# Altium schematic sheet FMC_DAC_1_5GS_4CH.schdoc: FMC DAC 1.5GS 4CH
size 420 x 297 mm; EDA_Number: ARTIQ; Projet: ARTIQ/SINARA; Author: G.Kasprowicz; CompanyName: WUT ISE; DrawnBy: G.Kasprowicz; Organization: WUT ISE; Address1: PW ISE; Address2: Nowowiejska 15/19 00-665 Warsaw; Address3: gkasprow@gmail.com; DocumentNumber: 1; Revision: 1; SheetNumber: 1; SheetTotal: 18; ModifiedBy: -; CheckedDate: -; Title2: Top; DivGrp: WUT ISE; Designer: G.Kasprowicz; ModifiedDate: -; ProjectName: Sensor Box
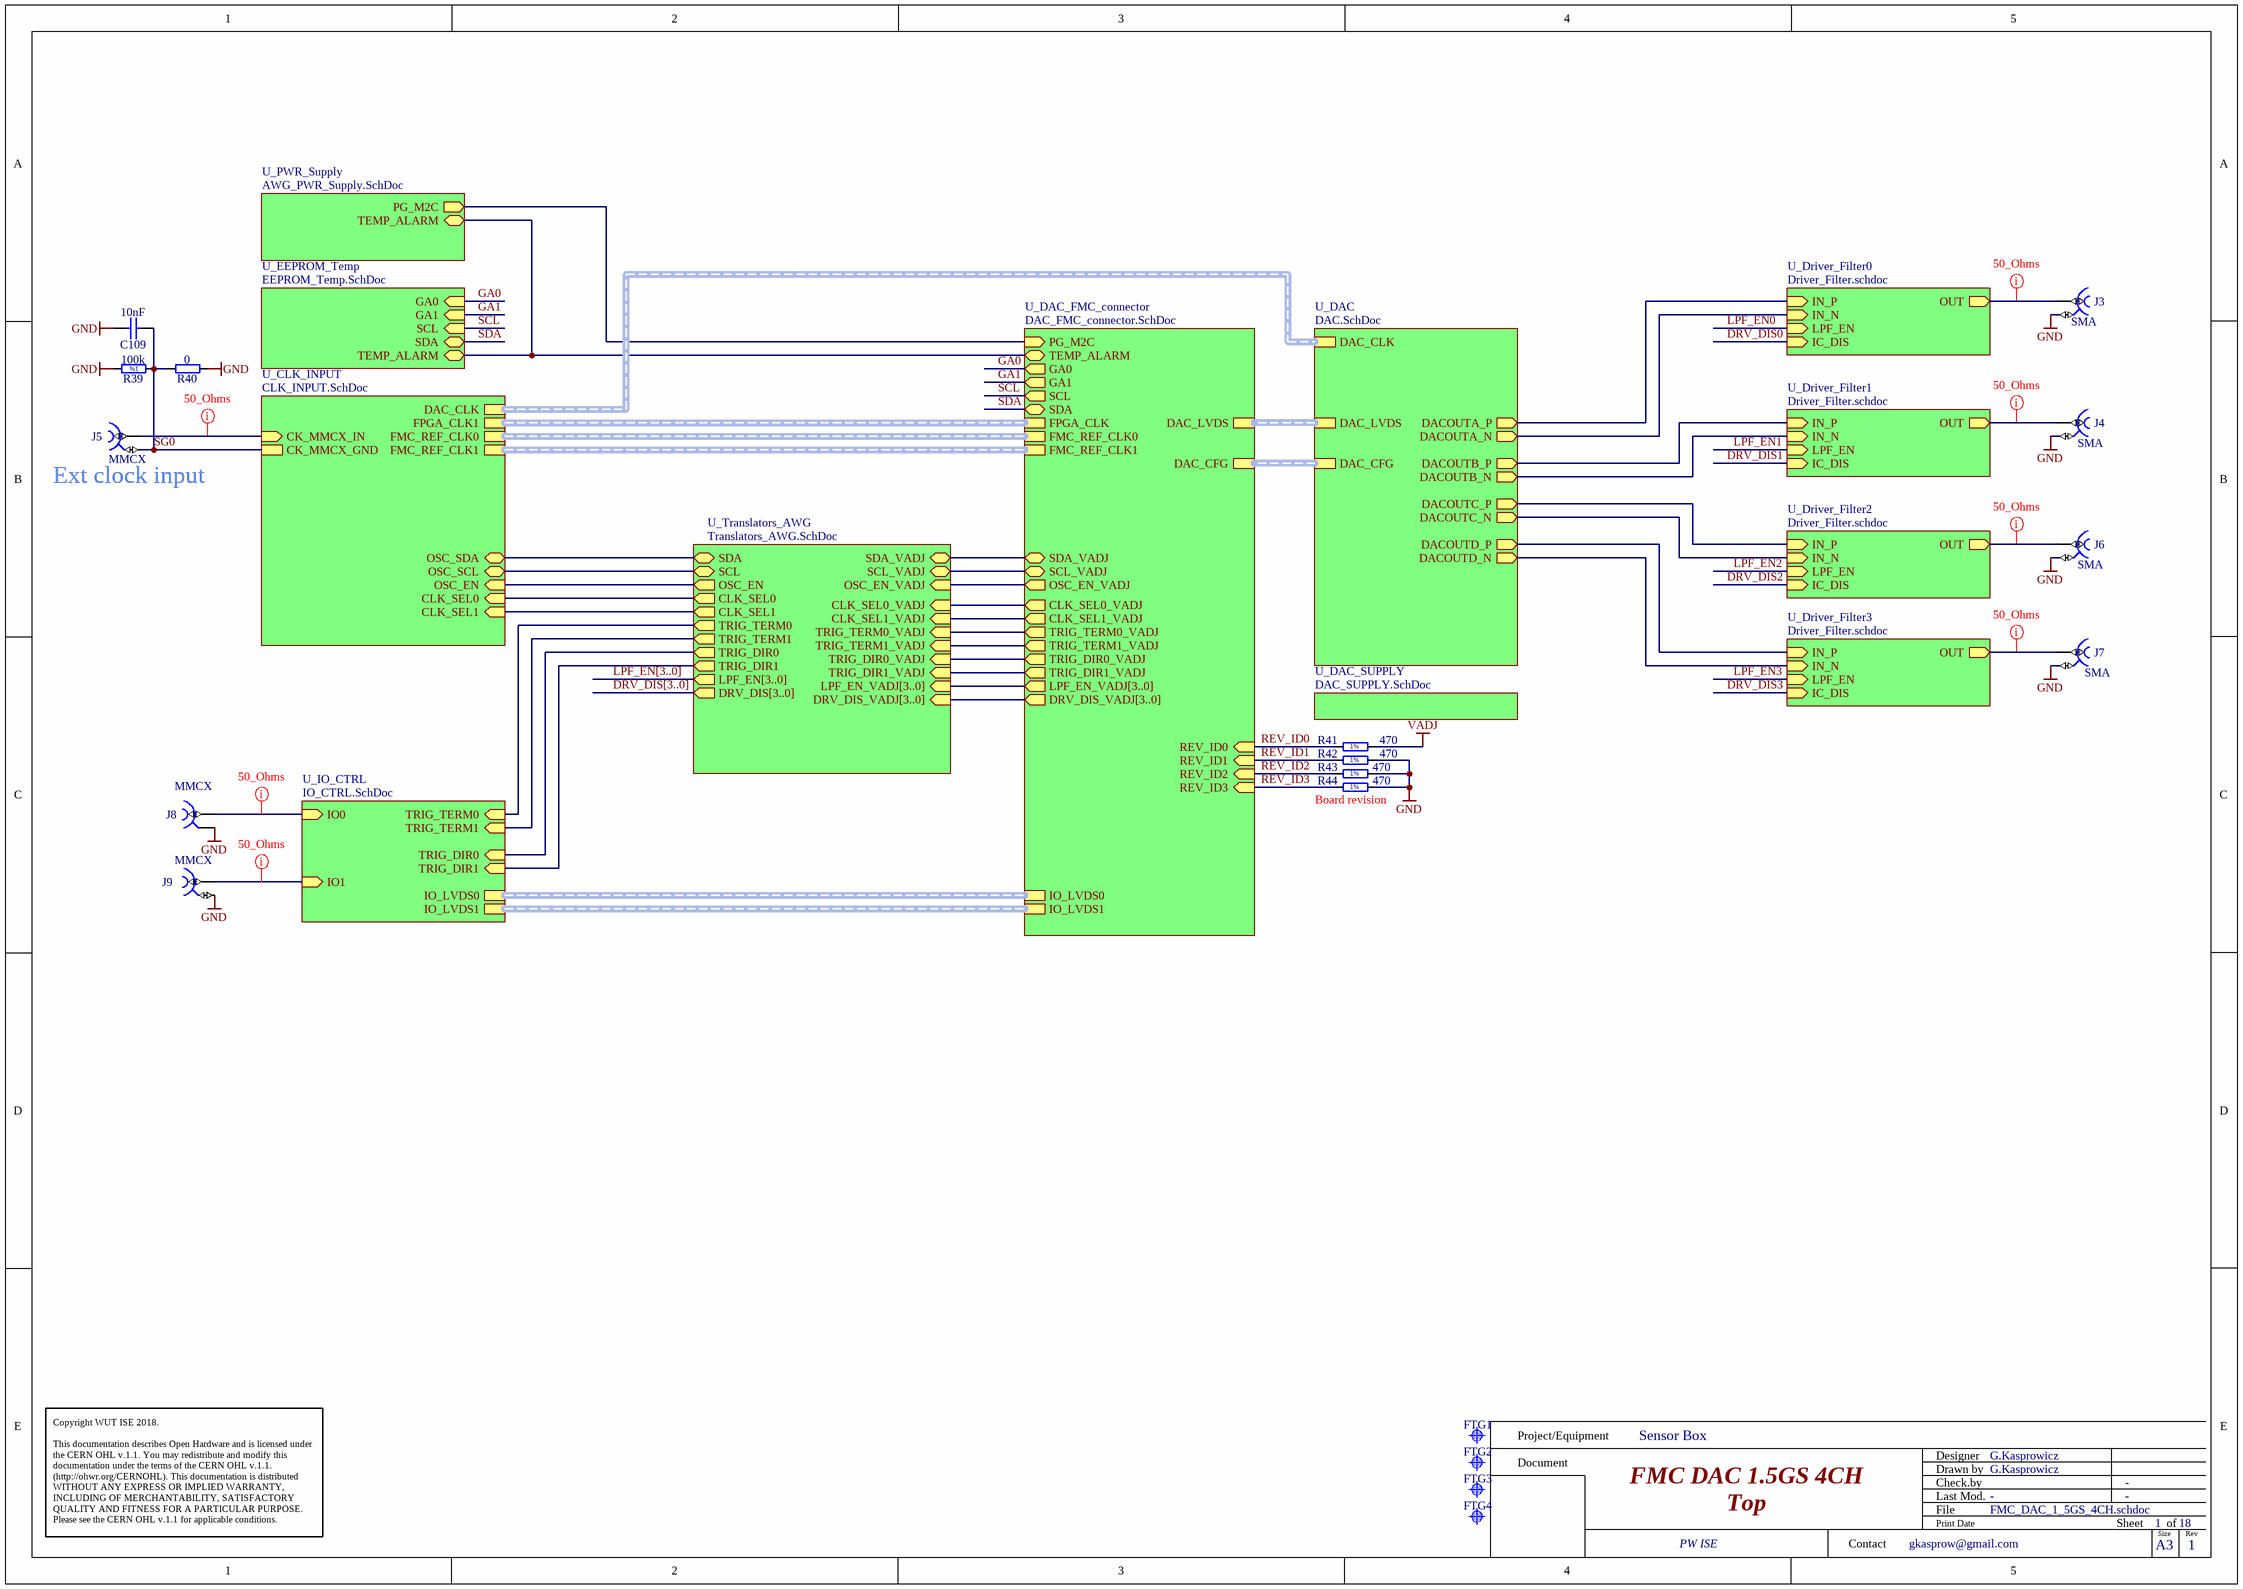
[diagram p0: FMC_DAC_1_5GS_4CH.schdoc]

## Parts
C109  10nF  [CAPC1005X55N]
FTG1  Use only in PCB  [FIDUCIAL_TOP_C100-200]  (value not drawn)  (no BOM)
FTG2  Use only in PCB  [FIDUCIAL_TOP_S100-200]  (value not drawn)  (no BOM)
FTG3  Use only in PCB  [FIDUCIAL_TOP_S100-200]  (value not drawn)  (no BOM)
FTG4  Use only in PCB  [FIDUCIAL_TOP_S100-200]  (value not drawn)  (no BOM)
J3  SMA  [AMPHENOL_901-143]
J4  SMA  [AMPHENOL_901-143]
J5  Family: MMCX  [HUBER-SUHNER_85_MMCX-50-0-1/111 OH]  (hidden comment: Coax_1Female_1Shield)
J6  SMA  [AMPHENOL_901-143]
J7  SMA  [AMPHENOL_901-143]
J8  Family: MMCX  [HUBER-SUHNER_85_MMCX-50-0-1/111 OH]  (hidden comment: Coax_1Female_1Shield)
J9  Family: MMCX  [HUBER-SUHNER_85_MMCX-50-0-1/111 OH]  (hidden comment: Coax_1Female_1Shield)
R39  100k  [RESC1005X40N]
R40  0  [RESC1608X55N]
R41  470  [RESC1005X40N]
R42  470  [RESC1005X40N]
R43  470  [RESC1005X40N]
R44  470  [RESC1005X40N]

## Sub-sheets
U_CLK_INPUT = CLK_INPUT.SchDoc: DAC_CLK (harness CLKDIFF), OSC_EN (in), OSC_SCL (bidir), OSC_SDA (bidir), CK_MMCX_GND, CK_MMCX_IN (in), FPGA_CLK1 (harness CLKDIFF), FMC_REF_CLK0 (harness DIFFCLK), CLK_SEL1 (in), FMC_REF_CLK1 (harness DIFFCLK), CLK_SEL0 (in)
U_DAC = DAC.SchDoc: DAC_CFG (harness DAC_CFG), DAC_LVDS (harness DAC_LVDS), DAC_CLK (harness CLKDIFF), DACOUTA_P (out), DACOUTA_N (out), DACOUTB_N (out), DACOUTB_P (out), DACOUTC_P (out), DACOUTC_N (out), DACOUTD_N (out), DACOUTD_P (out)
U_DAC_FMC_connector = DAC_FMC_connector.SchDoc: GA0 (out), GA1 (out), SCL (out), DAC_LVDS (harness DAC_LVDS), DAC_CFG (harness DAC_CFG), SDA (bidir), FPGA_CLK, TEMP_ALARM (bidir), PG_M2C (in), TRIG_DIR0_VADJ (out), TRIG_TERM0_VADJ (out), SDA_VADJ (bidir), SCL_VADJ (bidir), TRIG_DIR1_VADJ (out), TRIG_TERM1_VADJ (out), IO_LVDS0, IO_LVDS1, OSC_EN_VADJ (out), REV_ID0 (in), REV_ID1 (in), REV_ID2 (in), REV_ID3 (in), FMC_REF_CLK0, FMC_REF_CLK1, CLK_SEL0_VADJ (out), CLK_SEL1_VADJ (out), LPF_EN_VADJ[3..0] (out), DRV_DIS_VADJ[3..0] (out)
U_DAC_SUPPLY = DAC_SUPPLY.SchDoc: no entries
U_Driver_Filter0 = Driver_Filter.schdoc: IN_P (in), IN_N (in), OUT (out), LPF_EN (in), IC_DIS (in)
U_Driver_Filter1 = Driver_Filter.schdoc: IN_P (in), IN_N (in), OUT (out), LPF_EN (in), IC_DIS (in)
U_Driver_Filter2 = Driver_Filter.schdoc: IN_P (in), IN_N (in), OUT (out), LPF_EN (in), IC_DIS (in)
U_Driver_Filter3 = Driver_Filter.schdoc: IN_P (in), IN_N (in), OUT (out), LPF_EN (in), IC_DIS (in)
U_EEPROM_Temp = EEPROM_Temp.SchDoc: SDA (bidir), SCL (in), GA0 (in), GA1 (in), TEMP_ALARM (bidir)
U_IO_CTRL = IO_CTRL.SchDoc: TRIG_DIR0 (in), IO0 (in), TRIG_TERM0 (in), IO_LVDS0 (harness DIFFSIG), TRIG_DIR1 (in), IO1 (in), TRIG_TERM1 (in), IO_LVDS1 (harness DIFFSIG)
U_PWR_Supply = AWG_PWR_Supply.SchDoc: PG_M2C (out), TEMP_ALARM (bidir)
U_Translators_AWG = Translators_AWG.SchDoc: SDA_VADJ (bidir), SCL_VADJ (bidir), SDA (bidir), SCL (bidir), OSC_EN (out), TRIG_TERM0 (out), TRIG_TERM1 (out), TRIG_DIR0 (out), TRIG_DIR1 (out), TRIG_DIR0_VADJ (in), TRIG_DIR1_VADJ (in), TRIG_TERM0_VADJ (in), TRIG_TERM1_VADJ (in), OSC_EN_VADJ (in), CLK_SEL0 (out), CLK_SEL1 (out), CLK_SEL1_VADJ (in), CLK_SEL0_VADJ (in), LPF_EN[3..0] (out), DRV_DIS[3..0] (out), LPF_EN_VADJ[3..0] (in), DRV_DIS_VADJ[3..0] (in)

## Nets
GND: C109.2 J3.2 J4.2 J6.2 J7.2 J8.2 J9.2 R39.1 R40.1 R42.2 R43.2 R44.2
VADJ: R41.2
DRV_DIS0: sheet U_Driver_Filter0/IC_DIS
DRV_DIS1: sheet U_Driver_Filter1/IC_DIS
DRV_DIS2: sheet U_Driver_Filter2/IC_DIS
DRV_DIS3: sheet U_Driver_Filter3/IC_DIS
GA0: sheet U_DAC_FMC_connector/GA0, sheet U_EEPROM_Temp/GA0
GA1: sheet U_DAC_FMC_connector/GA1, sheet U_EEPROM_Temp/GA1
LPF_EN0: sheet U_Driver_Filter0/LPF_EN
LPF_EN1: sheet U_Driver_Filter1/LPF_EN
LPF_EN2: sheet U_Driver_Filter2/LPF_EN
LPF_EN3: sheet U_Driver_Filter3/LPF_EN
REV_ID0: R41.1 ; sheet U_DAC_FMC_connector/REV_ID0
REV_ID1: R42.1 ; sheet U_DAC_FMC_connector/REV_ID1
REV_ID2: R43.1 ; sheet U_DAC_FMC_connector/REV_ID2
REV_ID3: R44.1 ; sheet U_DAC_FMC_connector/REV_ID3
SCL: sheet U_DAC_FMC_connector/SCL, sheet U_EEPROM_Temp/SCL
SDA: sheet U_DAC_FMC_connector/SDA, sheet U_EEPROM_Temp/SDA
SG0: C109.1 J5.2 R39.2 R40.2 ; sheet U_CLK_INPUT/CK_MMCX_GND
NetJ3_1: J3.1 ; sheet U_Driver_Filter0/OUT
NetJ4_1: J4.1 ; sheet U_Driver_Filter1/OUT
NetJ5_1: J5.1 ; sheet U_CLK_INPUT/CK_MMCX_IN
NetJ6_1: J6.1 ; sheet U_Driver_Filter2/OUT
NetJ7_1: J7.1 ; sheet U_Driver_Filter3/OUT
NetJ8_1: J8.1 ; sheet U_IO_CTRL/IO0
NetJ9_1: J9.1 ; sheet U_IO_CTRL/IO1
(unnamed): sheet U_PWR_Supply/PG_M2C, sheet U_DAC_FMC_connector/PG_M2C
(unnamed): sheet U_PWR_Supply/TEMP_ALARM, sheet U_DAC_FMC_connector/TEMP_ALARM, sheet U_EEPROM_Temp/TEMP_ALARM
(unnamed): sheet U_CLK_INPUT/OSC_EN, sheet U_Translators_AWG/OSC_EN
(unnamed): sheet U_CLK_INPUT/OSC_SCL, sheet U_Translators_AWG/SCL
(unnamed): sheet U_CLK_INPUT/OSC_SDA, sheet U_Translators_AWG/SDA
(unnamed): sheet U_CLK_INPUT/CLK_SEL1, sheet U_Translators_AWG/CLK_SEL1
(unnamed): sheet U_CLK_INPUT/CLK_SEL0, sheet U_Translators_AWG/CLK_SEL0
(unnamed): sheet U_DAC/DACOUTA_P, sheet U_Driver_Filter0/IN_P
(unnamed): sheet U_DAC/DACOUTA_N, sheet U_Driver_Filter0/IN_N
(unnamed): sheet U_DAC/DACOUTB_N, sheet U_Driver_Filter1/IN_N
(unnamed): sheet U_DAC/DACOUTB_P, sheet U_Driver_Filter1/IN_P
(unnamed): sheet U_DAC/DACOUTC_P, sheet U_Driver_Filter2/IN_P
(unnamed): sheet U_DAC/DACOUTC_N, sheet U_Driver_Filter2/IN_N
(unnamed): sheet U_DAC/DACOUTD_N, sheet U_Driver_Filter3/IN_N
(unnamed): sheet U_DAC/DACOUTD_P, sheet U_Driver_Filter3/IN_P
(unnamed): sheet U_DAC_FMC_connector/TRIG_DIR0_VADJ, sheet U_Translators_AWG/TRIG_DIR0_VADJ
(unnamed): sheet U_DAC_FMC_connector/TRIG_TERM0_VADJ, sheet U_Translators_AWG/TRIG_TERM0_VADJ
(unnamed): sheet U_DAC_FMC_connector/SDA_VADJ, sheet U_Translators_AWG/SDA_VADJ
(unnamed): sheet U_DAC_FMC_connector/SCL_VADJ, sheet U_Translators_AWG/SCL_VADJ
(unnamed): sheet U_DAC_FMC_connector/TRIG_DIR1_VADJ, sheet U_Translators_AWG/TRIG_DIR1_VADJ
(unnamed): sheet U_DAC_FMC_connector/TRIG_TERM1_VADJ, sheet U_Translators_AWG/TRIG_TERM1_VADJ
(unnamed): sheet U_DAC_FMC_connector/OSC_EN_VADJ, sheet U_Translators_AWG/OSC_EN_VADJ
(unnamed): sheet U_DAC_FMC_connector/CLK_SEL0_VADJ, sheet U_Translators_AWG/CLK_SEL0_VADJ
(unnamed): sheet U_DAC_FMC_connector/CLK_SEL1_VADJ, sheet U_Translators_AWG/CLK_SEL1_VADJ
(unnamed): sheet U_Translators_AWG/TRIG_TERM0, sheet U_IO_CTRL/TRIG_TERM0
(unnamed): sheet U_Translators_AWG/TRIG_TERM1, sheet U_IO_CTRL/TRIG_TERM1
(unnamed): sheet U_Translators_AWG/TRIG_DIR0, sheet U_IO_CTRL/TRIG_DIR0
(unnamed): sheet U_Translators_AWG/TRIG_DIR1, sheet U_IO_CTRL/TRIG_DIR1

## Buses and harness runs
bus DRV_DIS[3..0] = sheet U_Translators_AWG/DRV_DIS[3..0]
bus LPF_EN[3..0] = sheet U_Translators_AWG/LPF_EN[3..0]
bus sheet U_DAC_FMC_connector/DRV_DIS_VADJ[3..0] = sheet U_Translators_AWG/DRV_DIS_VADJ[3..0]
bus sheet U_DAC_FMC_connector/LPF_EN_VADJ[3..0] = sheet U_Translators_AWG/LPF_EN_VADJ[3..0]
harness sheet U_CLK_INPUT/DAC_CLK = sheet U_DAC/DAC_CLK
harness sheet U_CLK_INPUT/FMC_REF_CLK0 = sheet U_DAC_FMC_connector/FMC_REF_CLK0
harness sheet U_CLK_INPUT/FMC_REF_CLK1 = sheet U_DAC_FMC_connector/FMC_REF_CLK1
harness sheet U_CLK_INPUT/FPGA_CLK1 = sheet U_DAC_FMC_connector/FPGA_CLK
harness sheet U_DAC/DAC_CFG = sheet U_DAC_FMC_connector/DAC_CFG
harness sheet U_DAC/DAC_LVDS = sheet U_DAC_FMC_connector/DAC_LVDS
harness sheet U_DAC_FMC_connector/IO_LVDS0 = sheet U_IO_CTRL/IO_LVDS0
harness sheet U_DAC_FMC_connector/IO_LVDS1 = sheet U_IO_CTRL/IO_LVDS1

## Layout directives
net class 50_Ohms: NetJ3_1, NetJ4_1, NetJ5_1, NetJ6_1, NetJ7_1, NetJ8_1, NetJ9_1

## Notes on the sheet
- (near J5) Ext clock input
- (near R44) Board revision
- Project/Equipment
- Document
- Designer
- Drawn by
- Check.by
- Copyright WUT ISE 2018.
  This documentation describes Open Hardware and is licensed under the CERN OHL v.1.1. You may redistribute and modify this documentation under the terms of the CERN OHL v.1.1. (http://ohwr.org/CERNOHL). This documentation is distributed WITHOUT ANY EXPRESS OR IMPLIED WARRANTY, INCLUDING OF MERCHANTABILITY, SATISFACTORY QUALITY AND FITNESS FOR A PARTICULAR PURPOSE. Please see the CERN OHL v.1.1 for applicable conditions.
- Contact
- File
- Last Mod.
- Print Date
- Sheet
- Size
- A3
- of
- Rev
- (in symbol R0402_100K_1%_0.0625W_100PPM) 1%
- (in symbol R0402_470R_1%_0.0625W_100PPM) 1%

## Library data of the parts
C109 = CC0402_10NF_16V_10%_X7R: Non-polarised capacitor; Part Description: SMD Multilayer Chip Ceramic Capacitor; Manufacturer: GENERIC; Manufacturer1 Part Number: 223878715636; Voltage: 16V; TC: X7R; Tolerance: ±10%; Part Number: CC0402_10NF_16V_10%_X7R; Component Kind: Standard; Component Type: Standard; Pin Count: 2; Value: 10nF; Status: Not Recommended; Manufacturer Part Number: CC0402_10NF_16V_10%_X7R; Case: 0402; Mounted: Yes; Socket: No; SMD: Yes; Sense: No; Manufacturer1 Example: PHYCOMP; Manufacturer1 ComponentHeight: 0.55mm; HelpURL: \\cern.ch\dfs\Applications\Altium\Datasheets\CC0402_X7R_PHYCOMP.pdf; Author: CERN DEM JLC; CreateDate: 2007-12-03; LatestRevisionDate: 2007-12-03
FTG1 = FIDUCIAL_TARGET_C100-200: Fiducial Target; Part Description: Round Fiducial Target, Top Layer, 1.0mm, Top Solder 2.0mm, Keepout =2.0mm; Mounted: No; Part Number: FIDUCIAL_TARGET_C100-200; Component Type: Standard (No BOM); Pin Count: 1; Family: Fiducial; Socket: No; SMD: Yes; Sense: No; Status: None; ComponentHeight: 0mm; HelpURL: Undefined; Author: CERN DEM JLC; CreateDate: 09.02.2010; LatestRevisionDate: 04.04.2012; PackageDescription: Round Fiducial Target, Top Layer, 1.0mm, Top Solder 2.0mm, Keepout =2.0mm
FTG2-FTG4 = FIDUCIAL_TARGET_S100-200: Fiducial Target; Part Description: Square Fiducial Target, Top Layer, 1.0mm, Top Solder 2.0mm, Keepout =2.0mm; Mounted: No; Part Number: FIDUCIAL_TARGET_S100-200; Component Type: Standard (No BOM); Pin Count: 1; Family: Fiducial; Socket: No; SMD: Yes; Sense: No; Status: None; ComponentHeight: 0mm; HelpURL: Undefined; Author: CERN DEM JLC; CreateDate: 09.02.2010; LatestRevisionDate: 04.04.2012; PackageDescription: Square Fiducial Target, Top Layer, 1.0mm, Top Solder 2.0mm, Keepout =2.0mm
J3 J4 J6 J7 = Coax_1Female_1Shield: Part Description: 50 Ohm Through Hole SMA 90 degrees PCB Jack; Manufacturer: AMPHENOL; Manufacturer Part Number: 901-143; PressFit: No; Part Number: AMPHENOL_901-143; Component Kind: Standard; Component Type: Standard; Pin Count: 5; Family: SMA; Mounted: Yes; Socket: No; SMD: No; Sense: No; Status: None; ComponentHeight: 10.0mm; Author: LNLS DIG GBMB; CreateDate: 31/05/2016; LatestRevisionDate: 31/05/2016
J5 J8 J9 = HUBER-SUHNER_85_MMCX-50-0-1/111 OH: Part Description: MMCX 50 Ohms Right Angle PCB Jack; Manufacturer: HUBER+SUHNER; Table: Miscellaneous; Part Number: HUBER-SUHNER_85_MMCX-50-0-1/111 OH; Component Kind: Standard; Component Type: Standard; Pin Count: 2; Mounted: Yes; Socket: No; SMD: No; Status: None; Manufacturer Part Number: 85_MMCX-50-0-1/111 OH; ComponentHeight: 9.6mm; HelpURL: \\cern.ch\dfs\Applications\Altium\Datasheets\HUBER-SUHNER_85_MMCX-50-0-1-111 OH.pdf; Author: CERN DEM JLC; CreateDate: 2011-10-04; LatestRevisionDate: 2011-10-04
R39 = R0402_100K_1%_0.0625W_100PPM: Resistor - 1%; Part Description: General Purpose Thick Film Chip Resistor; Manufacturer: GENERIC; Manufacturer1 Part Number: 232270671004L; PressFit: No; TC: ±100ppm/°C; Part Number: R0402_100K_1%_0.0625W_100PPM; Component Kind: Standard; Component Type: Standard; Pin Count: 2; Value: 100k; Status: Not Recommended; Manufacturer Part Number: R0402_100K_1%_0.0625W_100PPM; Case: 0402; Mounted: Yes; Sense: No; Socket: No; SMD: Yes; Manufacturer1 Example: YAGEO PHYCOMP; Manufacturer1 ComponentHeight: 0.4mm; HelpURL: \\cern.ch\dfs\Applications\Altium\Datasheets\R0402_Phycomp_RC0402.pdf; Author: CERN DEM JLC; CreateDate: 03.12.2007; LatestRevisionDate: 17.10.2012; Power: 0.0625W; Tolerance: ±1%
R40 = R0603_0R_JUMPER: Resistor; Part Description: 1A (0.05R Max DC Resistance) Zero Ohm Jumper; Manufacturer: GENERIC; Manufacturer1 Part Number: NRC06Z0; PressFit: No; Part Number: R0603_0R_JUMPER; Component Kind: Standard; Component Type: Standard; Pin Count: 2; Value: 0; Status: Preferred; Manufacturer Part Number: R0603_0R_JUMPER; Case: 0603; Mounted: Yes; Sense: No; Socket: No; SMD: Yes; Manufacturer1 Example: NIC COMPONENT; Manufacturer1 ComponentHeight: 0.55mm; HelpURL: \\cern.ch\dfs\Applications\Altium\Datasheets\R0603_NIC_NRC.pdf; Author: CERN DEM JLC; CreateDate: 03.12.2007; LatestRevisionDate: 13.03.2008
R41-R44 = R0402_470R_1%_0.0625W_100PPM: Resistor - 1%; Part Description: General Purpose Thick Film Chip Resistor; Manufacturer: GENERIC; Manufacturer1 Part Number: 232270674701L; TC: ±100ppm/°C; PressFit: No; Part Number: R0402_470R_1%_0.0625W_100PPM; Component Kind: Standard; Component Type: Standard; Pin Count: 2; Value: 470; Status: Not Recommended; Power: 0.0625W; Tolerance: ±1%; Manufacturer Part Number: R0402_470R_1%_0.0625W_100PPM; Case: 0402; Mounted: Yes; Sense: No; Socket: No; SMD: Yes; Manufacturer1 Example: YAGEO PHYCOMP; Manufacturer1 ComponentHeight: 0.4mm; HelpURL: \\cern.ch\dfs\Applications\Altium\Datasheets\R0402_Phycomp_RC0402.pdf; Author: CERN DEM JLC; CreateDate: 03.12.2007; LatestRevisionDate: 17.10.2012